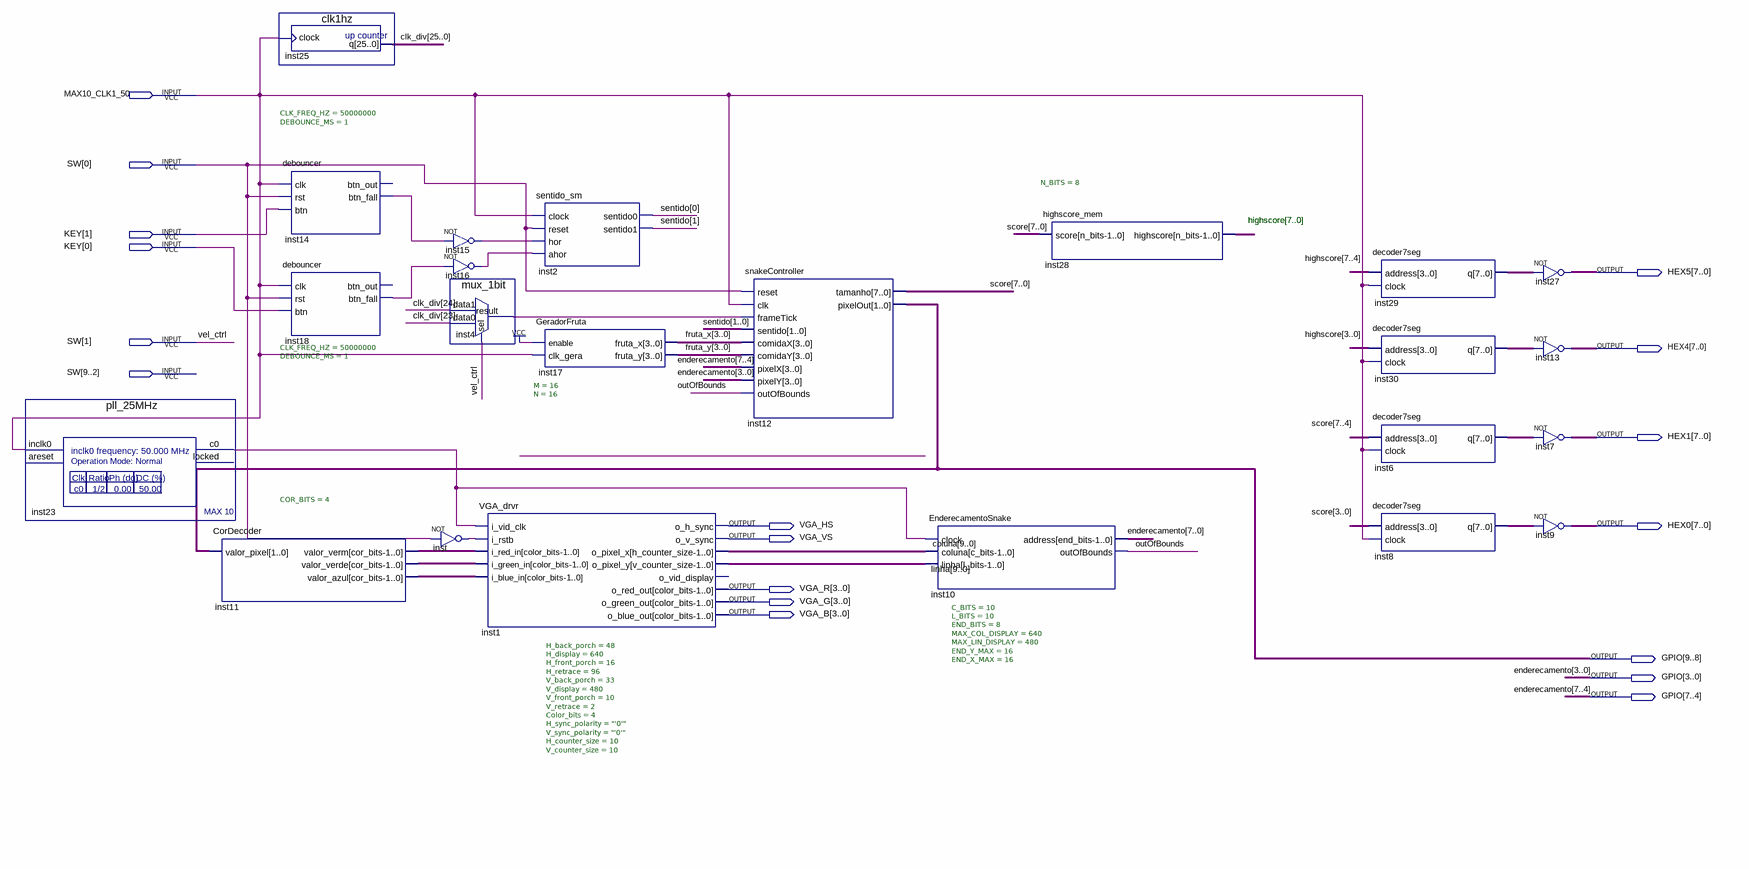
[diagram p0: schematic sheet]
// Quartus schematic snake-game-fpga.bdf as structural Verilog: 23 symbols, 18 pins
module \snake-game-fpga  (
  input  MAX10_CLK1_50,
  input  [9:0] SW,
  input  [1:0] KEY,
  output [7:0] HEX5,
  output [7:0] HEX4,
  output [7:0] HEX1,
  output VGA_HS,
  output [7:0] HEX0,
  output VGA_VS,
  output [3:0] VGA_R,
  output [3:0] VGA_G,
  output [3:0] VGA_B,
  output [9:0] GPIO
);

  wire inst4_result, inst14_btn_fall, inst15_out, inst16_out, inst18_btn_fall, inst23_c0, inst_out,
       outOfBounds;
  wire [1:0] sentido;
  wire [3:0] fruta_x, fruta_y, inst11_valor_azul, inst11_valor_verde, inst11_valor_verm;
  wire [7:0] highscore, inst6_q, inst8_q, inst29_q, inst30_q, score;
  wire [9:0] coluna, linha;
  wire [25:0] clk_div;

  pll_25MHz inst23 (.inclk0(MAX10_CLK1_50), .c0(inst23_c0));  // open: areset, locked
  CorDecoder #(.COR_BITS(4)) inst11 (
    .valor_pixel(GPIO[9:8]), .valor_verm(inst11_valor_verm), .valor_verde(inst11_valor_verde),
    .valor_azul(inst11_valor_azul));
  clk1hz inst25 (.clock(MAX10_CLK1_50), .q(clk_div));
  debouncer #(.CLK_FREQ_HZ(50000000), .DEBOUNCE_MS(1)) inst14 (
    .clk(MAX10_CLK1_50), .rst(SW[0]), .btn(KEY[1]), .btn_fall(inst14_btn_fall));  // open: btn_out
  debouncer #(.CLK_FREQ_HZ(50000000), .DEBOUNCE_MS(1)) inst18 (
    .clk(MAX10_CLK1_50), .rst(SW[0]), .btn(KEY[0]), .btn_fall(inst18_btn_fall));  // open: btn_out
  not inst (inst_out, SW[0]);
  not inst15 (inst15_out, inst14_btn_fall);
  not inst16 (inst16_out, inst18_btn_fall);
  mux_1bit inst4 (.data1(clk_div[24]), .data0(clk_div[23]), .sel(SW[1]), .result(inst4_result));
  VGA_drvr #(.H_back_porch(48), .H_display(640), .H_front_porch(16), .H_retrace(96), .V_back_porch(33), .V_display(480), .V_front_porch(10), .V_retrace(2), .Color_bits(4), .H_sync_polarity("'0'"), .V_sync_polarity("'0'"), .H_counter_size(10), .V_counter_size(10)) inst1 (
    .i_vid_clk(inst23_c0), .i_rstb(inst_out), .i_red_in(inst11_valor_verm), .i_green_in(inst11_valor_verde),
    .i_blue_in(inst11_valor_azul), .o_h_sync(VGA_HS), .o_v_sync(VGA_VS), .o_pixel_x(coluna),
    .o_pixel_y(linha), .o_red_out(VGA_R), .o_green_out(VGA_G), .o_blue_out(VGA_B));  // open: o_vid_display
  sentido_sm inst2 (
    .clock(MAX10_CLK1_50), .reset(SW[0]), .hor(inst15_out), .ahor(inst16_out), .sentido0(sentido[0]),
    .sentido1(sentido[1]));
  GeradorFruta #(.M(16), .N(16)) inst17 (.enable(1'b1), .clk_gera(MAX10_CLK1_50), .fruta_x(fruta_x), .fruta_y(fruta_y));
  snakeController inst12 (
    .reset(SW[0]), .clk(MAX10_CLK1_50), .frameTick(inst4_result), .sentido(sentido), .comidaX(fruta_x),
    .comidaY(fruta_y), .pixelX(GPIO[7:4]), .pixelY(GPIO[3:0]), .outOfBounds(outOfBounds), .tamanho(score),
    .pixelOut(GPIO[9:8]));
  EnderecamentoSnake #(.C_BITS(10), .L_BITS(10), .END_BITS(8), .MAX_COL_DISPLAY(640), .MAX_LIN_DISPLAY(480), .END_Y_MAX(16), .END_X_MAX(16)) inst10 (
    .clock(inst23_c0), .coluna(coluna), .linha(linha), .address(GPIO[7:0]), .outOfBounds(outOfBounds));
  highscore_mem #(.N_BITS(8)) inst28 (.score(score), .highscore(highscore));
  decoder7seg inst29 (.address(highscore[7:4]), .clock(MAX10_CLK1_50), .q(inst29_q));
  decoder7seg inst30 (.address(highscore[3:0]), .clock(MAX10_CLK1_50), .q(inst30_q));
  decoder7seg inst6 (.address(score[7:4]), .clock(MAX10_CLK1_50), .q(inst6_q));
  decoder7seg inst8 (.address(score[3:0]), .clock(MAX10_CLK1_50), .q(inst8_q));
  assign HEX5 = ~inst29_q;  // NOT inst27, 8 bits wide
  assign HEX4 = ~inst30_q;  // NOT inst13, 8 bits wide
  assign HEX1 = ~inst6_q;  // NOT inst7, 8 bits wide
  assign HEX0 = ~inst8_q;  // NOT inst9, 8 bits wide

  // Other names for the same wires on the sheet: enderecamento[7:0] = GPIO[7:0]; vel_ctrl = SW[1]

  // Notes on the sheet:
  //   highscore[7..0]
endmodule
